# EAGLE schematic dp_linistepper.v1.0 (EAGLE 6.3)
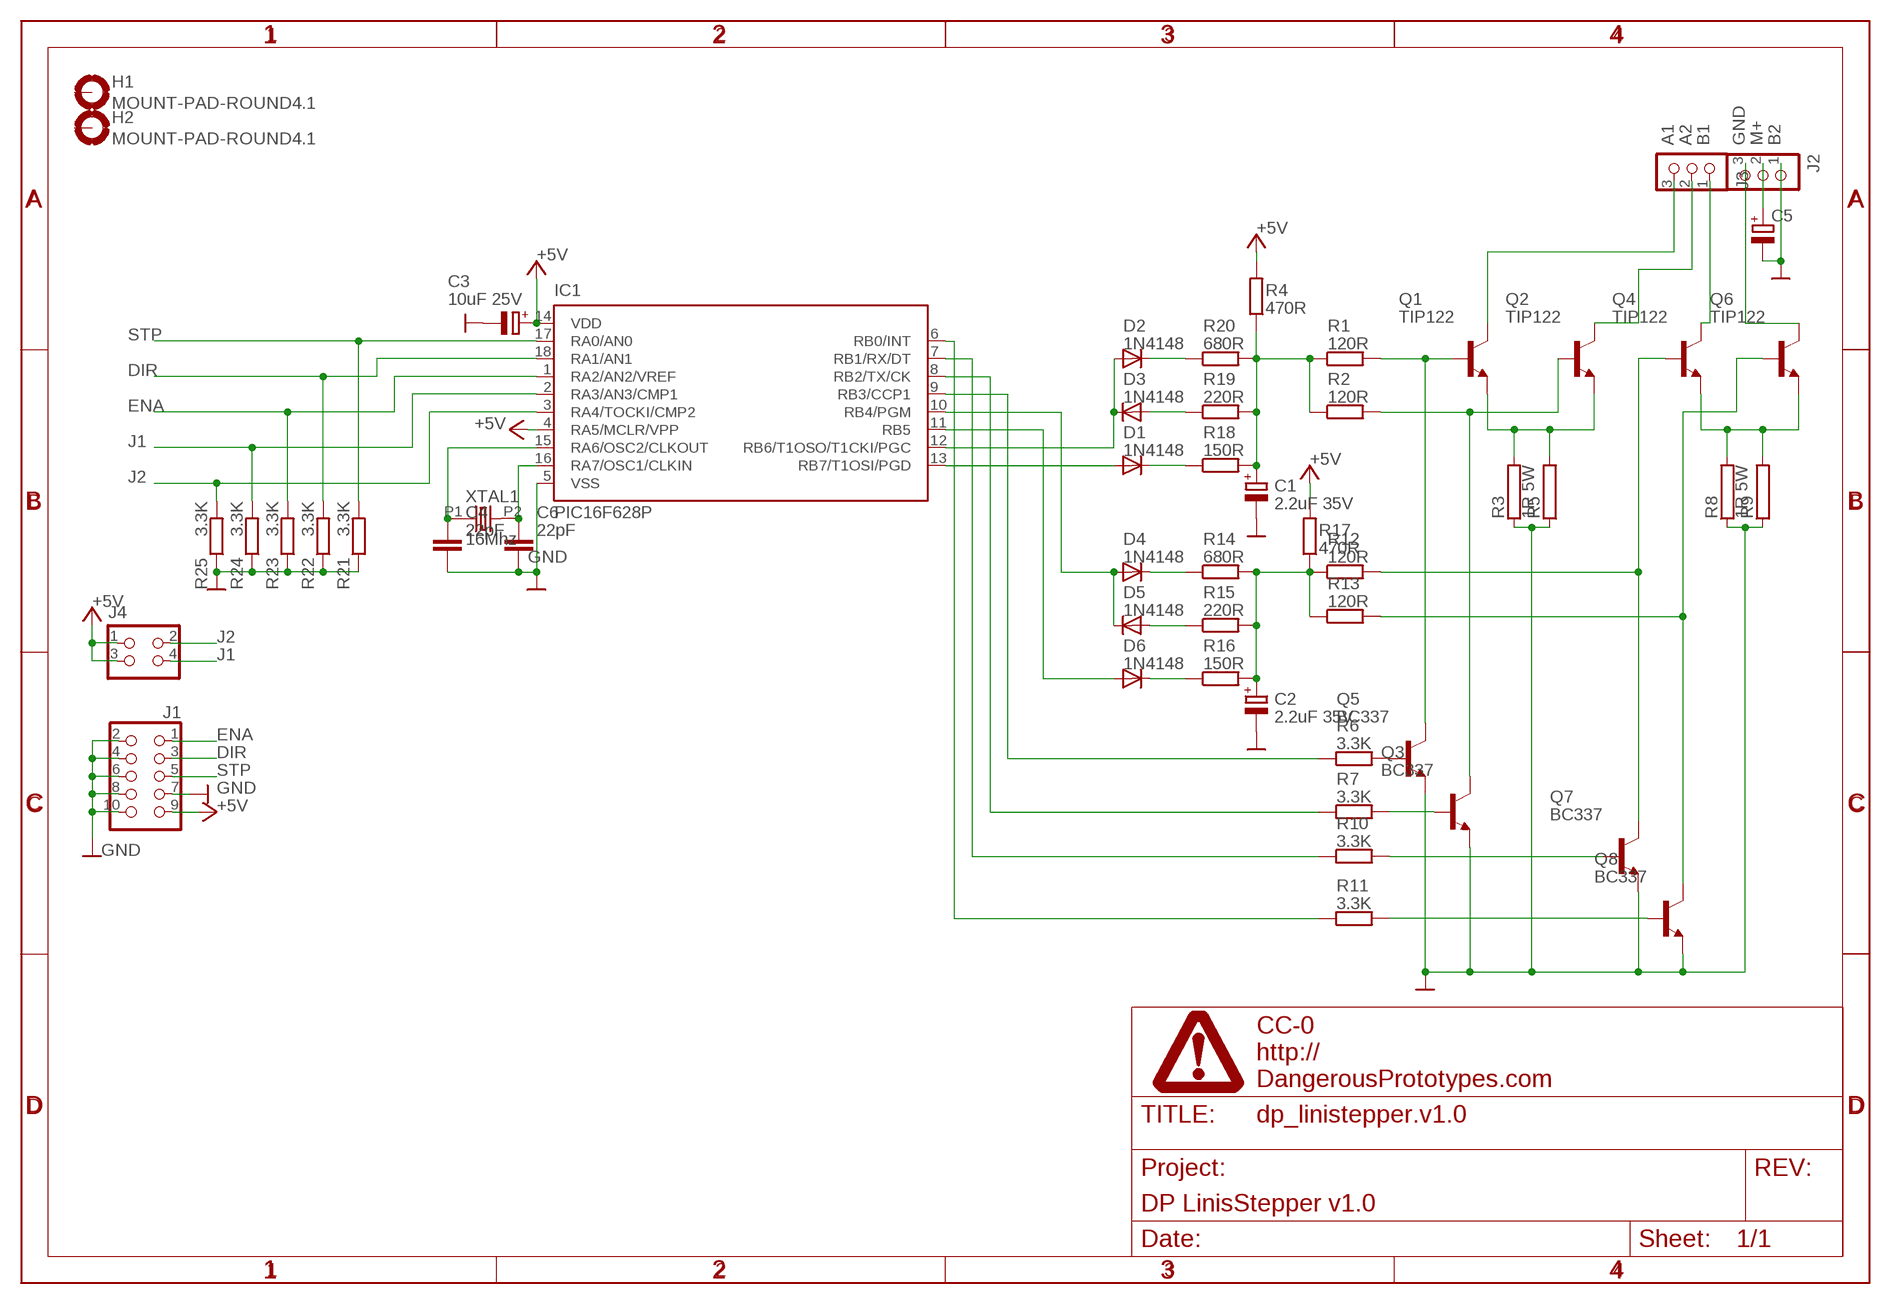
[diagram p0: schematic, sheet 1]

## Parts
C1  2.2uF 35V  CPOL-EUETR1  [ETR1]
C2  2.2uF 35V  CPOL-EUETR1  [ETR1]
C3  10uF 25V  CPOL-EUETR1  [ETR1]
C4  22pF  CAPACITOR_NPOL-PTH_0.1"  [C0.1PTH]
C5  CPOL-EUE5-13  [E5-13]
C6  22pF  CAPACITOR_NPOL-PTH_0.1"  [C0.1PTH]
D1  1N4148  [DO35-10]
D2  1N4148  [DO35-10]
D3  1N4148  [DO35-10]
D4  1N4148  [DO35-10]
D5  1N4148  [DO35-10]
D6  1N4148  [DO35-10]
H1  MOUNT-PAD-ROUND4.1  [4,1-PAD]
H2  MOUNT-PAD-ROUND4.1  [4,1-PAD]
IC1  PIC16F628P  [DIL18]
J1  CON_HEADER_2X05-PTH  [M2X5]
J2  CON_TERMINAL_BLOCK_03-5MM  [TERMINAL_BLOCK_3P_5]
J3  CON_TERMINAL_BLOCK_03-5MM  [TERMINAL_BLOCK_3P_5]
J4  CON_HEADER_2X02-PTH  [M2X2]
Q1  TIP122  2SC2098V  [TO220AV]
Q2  TIP122  2SC2098V  [TO220AV]
Q3  BC337  [TO92]
Q4  TIP122  2SC2098V  [TO220AV]
Q5  BC337  [TO92]
Q6  TIP122  2SC2098V  [TO220AV]
Q7  BC337  [TO92]
Q8  BC337  [TO92]
R1  120R  RESISTOR-PTH-0.4  [RTH025W]
R2  120R  RESISTOR-PTH-0.4  [RTH025W]
R3  1R 5W  RHPS923  [HPS923]
R4  470R  RESISTOR-PTH-0.4  [RTH025W]
R5  RHPS63  [HPS63]
R6  3.3K  RESISTOR-PTH-0.4  [RTH025W]
R7  3.3K  RESISTOR-PTH-0.4  [RTH025W]
R8  1R 5W  RHPS923  [HPS923]
R9  RHPS63  [HPS63]
R10  3.3K  RESISTOR-PTH-0.4  [RTH025W]
R11  3.3K  RESISTOR-PTH-0.4  [RTH025W]
R12  120R  RESISTOR-PTH-0.4  [RTH025W]
R13  120R  RESISTOR-PTH-0.4  [RTH025W]
R14  680R  RESISTOR-PTH-0.4  [RTH025W]
R15  220R  RESISTOR-PTH-0.4  [RTH025W]
R16  150R  RESISTOR-PTH-0.4  [RTH025W]
R17  470R  RESISTOR-PTH-0.4  [RTH025W]
R18  150R  RESISTOR-PTH-0.4  [RTH025W]
R19  220R  RESISTOR-PTH-0.4  [RTH025W]
R20  680R  RESISTOR-PTH-0.4  [RTH025W]
R21  3.3K  RESISTOR-PTH-0.4  [RTH025W]
R22  3.3K  RESISTOR-PTH-0.4  [RTH025W]
R23  3.3K  RESISTOR-PTH-0.4  [RTH025W]
R24  3.3K  RESISTOR-PTH-0.4  [RTH025W]
R25  3.3K  RESISTOR-PTH-0.4  [RTH025W]
U$1  FRAME_DINA4_L  [DP_LOGO]
XTAL1  16Mhz  OSC-XTAL-HC-49U-PTH  [HC-49U-PTH]

## Nets
+5V: C3.+ IC1.4(RA5/MCLR/VPP) IC1.14(VDD) J1.9 J4.1 J4.3 R4.2 R17.2 ; supply symbol labelled SUPPLY_+5V
A1: J3.3 Q1.2(C)
A2: J3.2 Q2.2(C)
B1: J3.1 Q4.2(C)
B2: J2.3 Q6.2(C)
DIR: IC1.18(RA1/AN1) J1.3 R22.2
ENA: IC1.1(RA2/AN2/VREF) J1.1 R23.2
GND: C1.- C2.- C3.- C4.2 C5.- C6.2 IC1.5(VSS) J1.2 J1.4 J1.6 J1.7 J1.8 J1.10 J2.1 Q3.1(E) Q5.1(E) Q7.1(E) Q8.1(E) R3.1 R5.1 R8.1 R9.1 R21.1 R22.1 R23.1 R24.1 R25.1 ; supply symbol labelled SUPPLY_GND
J1: IC1.2(RA3/AN3/CMP1) J4.4 R24.2
J2: IC1.3(RA4/TOCKI/CMP2) J4.2 R25.2
M+: C5.+ J2.2
N$1: C4.1 IC1.15(RA6/OSC2/CLKOUT) XTAL1.P1
N$2: C6.1 IC1.16(RA7/OSC1/CLKIN) XTAL1.P2
N$3: D1.C R18.1
N$4: D2.C R20.1
N$5: D3.A R19.1
N$6: C1.+ R1.1 R2.1 R4.1 R18.2 R19.2 R20.2
N$7: D2.A D3.C IC1.12(RB6/T1OSO/T1CKI/PGC)
N$8: D1.A IC1.13(RB7/T1OSI/PGD)
N$9: Q1.1(B) Q5.3(C) R1.2
N$10: Q1.3(E) Q2.3(E) R3.2 R5.2
N$11: Q2.1(B) Q3.3(C) R2.2
N$13: Q5.2(B) R6.2
N$14: Q3.2(B) R7.2
N$15: IC1.9(RB3/CCP1) R6.1
N$16: IC1.8(RB2/TX/CK) R7.1
N$17: Q4.3(E) Q6.3(E) R8.2 R9.2
N$19: Q7.2(B) R10.2
N$20: Q8.2(B) R11.2
N$21: IC1.7(RB1/RX/DT) R10.1
N$22: IC1.6(RB0/INT) R11.1
N$23: Q4.1(B) Q7.3(C) R12.2
N$24: Q6.1(B) Q8.3(C) R13.2
N$25: C2.+ R12.1 R13.1 R14.2 R15.2 R16.2 R17.1
N$26: D4.C R14.1
N$27: D5.A R15.1
N$28: D6.C R16.1
N$30: D4.A D5.C IC1.10(RB4/PGM)
N$32: D6.A IC1.11(RB5)
STP: IC1.17(RA0/AN0) J1.5 R21.2
Unconnected: H1.B4,1(MOUNT) H2.B4,1(MOUNT)

## Library data of the parts
C1-C3 C5 = rcl:CPOL-EU: POLARIZED CAPACITOR, European symbol
C4 C6 = dp_devices:CAPACITOR_NPOL: Non-Polarized capacitor in various packages
D1-D6 = 11 Trosh diodes:1N4148: DIODE high speed (Philips)
H1 H2 = holes:MOUNT-PAD-ROUND: MOUNTING PAD, round
IC1 = microchip:PIC16F62*: FLASH-Based 8-Bit CMOS Microcontroller Source: http://ww1.microchip.com/downloads/en/DeviceDoc/40300C.pdf; MF: MICROCHIP; MPN: PIC16F628-04I/P; OC_FARNELL: 9760407; OC_NEWARK: 19C7272
J1 = dp_devices:CON_HEADER_2X05: 2x05 pin header
J2 J3 = dp_devices:CON_TERMINAL_BLOCK_03: 3 poles, wire to board connector
J4 = dp_devices:CON_HEADER_2X02
Q1 Q2 Q4 Q6 = transistor:2SC2098: NPN Epitaxial Planar Transistor RF Power Amplivier Source: 2SC2098.pdf
Q3 Q5 Q7 Q8 = transistor:BC337: NPN TRANSISTOR
R1 R2 R4 R6 R7 R10-R25 = dp_devices:RESISTOR
R3 R5 R8 R9 = resistor-power:R: Power Resitor; OC_FARNELL: unknown; OC_NEWARK: unknown
U$1 = dp_devices:FRAME_DINA4_L: A4 DP frame Standard Dangerous Prototypes schematic frame. Automagically adds the DP logo and standard texts to the PCB Use the atrribute in the schematic editor to change the fields.; FF1: fulfillment by; FF2: Seeed Studio; FF3: www.seeedstudio.com; LICENSE: CC-0; PROJECT: DP LinisStepper v1.0; URL1: http://; URL2: DangerousPrototypes.com
XTAL1 = dp_devices:OSC-XTAL